# EAGLE design MIDI-Patchbay-Display (EAGLE 8.4.2)
RGB Rotary Encoder Breakout Board
CNAME: RGB Encoder Breakout; CREVISION: 1.0; DESIGNER: Andy Wardley
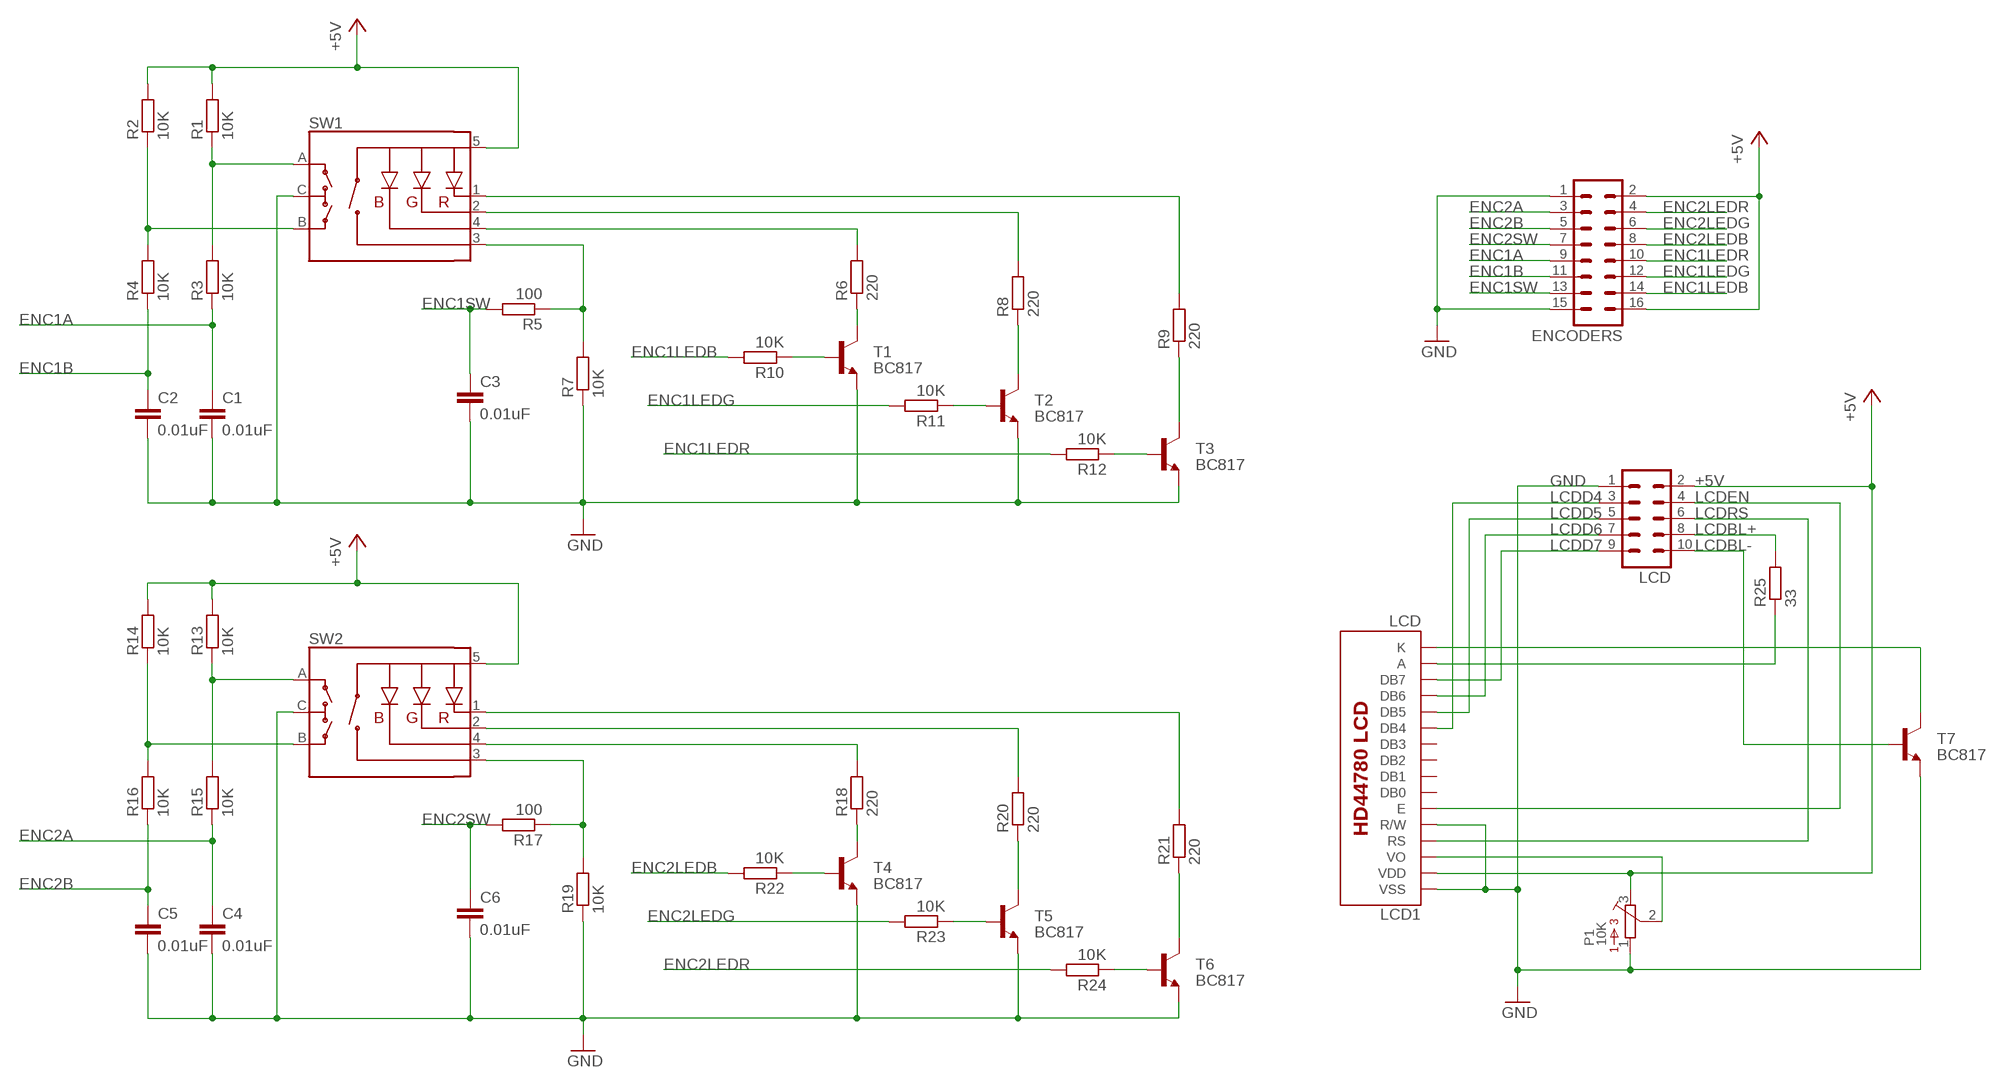
[diagram p0: schematic, sheet 1]

## Parts
C1  0.01uF  CAPACITOR  [0805]
C2  0.01uF  CAPACITOR  [0805]
C3  0.01uF  CAPACITOR  [0805]
C4  0.01uF  CAPACITOR  [0805]
C5  0.01uF  CAPACITOR  [0805]
C6  0.01uF  CAPACITOR  [0805]
ENCODERS  ML16  [ML16]
LCD  ML10  [ML10]
LCD1  LCD  LCD-HD447804-HOLES16X2-4-HOLES  [LCD-16X2-4HOLES]
P1  10K  3296W_TRIM_POT  [3386W]
R1  10K  RESISTORR0805  [R0805]
R2  10K  RESISTORR0805  [R0805]
R3  10K  RESISTORR0805  [R0805]
R4  10K  RESISTORR0805  [R0805]
R5  100  RESISTORR0805  [R0805]
R6  220  RESISTORR0805  [R0805]
R7  10K  RESISTORR0805  [R0805]
R8  220  RESISTORR0805  [R0805]
R9  220  RESISTORR0805  [R0805]
R10  10K  RESISTORR0805  [R0805]
R11  10K  RESISTORR0805  [R0805]
R12  10K  RESISTORR0805  [R0805]
R13  10K  RESISTORR0805  [R0805]
R14  10K  RESISTORR0805  [R0805]
R15  10K  RESISTORR0805  [R0805]
R16  10K  RESISTORR0805  [R0805]
R17  100  RESISTORR0805  [R0805]
R18  220  RESISTORR0805  [R0805]
R19  10K  RESISTORR0805  [R0805]
R20  220  RESISTORR0805  [R0805]
R21  220  RESISTORR0805  [R0805]
R22  10K  RESISTORR0805  [R0805]
R23  10K  RESISTORR0805  [R0805]
R24  10K  RESISTORR0805  [R0805]
R25  33  RESISTORR0805  [R0805]
SW1  ENCODER_RGB_CA  [ENCODER_LED_3]
SW2  ENCODER_RGB_CA  [ENCODER_LED_3]
T1  BC817  [SOT23]
T2  BC817  [SOT23]
T3  BC817  [SOT23]
T4  BC817  [SOT23]
T5  BC817  [SOT23]
T6  BC817  [SOT23]
T7  BC817  [SOT23]

## Nets
+5V: ENCODERS.2 ENCODERS.16 LCD1.2(VDD) LCD.2 P1.3 R1.2 R2.2 R13.2 R14.2 SW1.5(+) SW2.5(+)
ENC1A: C1.1 ENCODERS.9 R3.1
ENC1APIN: R1.1 R3.2 SW1.A
ENC1B: C2.1 ENCODERS.11 R4.1
ENC1BPIN: R2.1 R4.2 SW1.B
ENC1LEDB: ENCODERS.14 R10.2
ENC1LEDG: ENCODERS.12 R11.2
ENC1LEDR: ENCODERS.10 R12.2
ENC1SW: C3.1 ENCODERS.13 R5.2
ENC2A: C4.1 ENCODERS.3 R15.1
ENC2APIN: R13.1 R15.2 SW2.A
ENC2B: C5.1 ENCODERS.5 R16.1
ENC2BPIN: R14.1 R16.2 SW2.B
ENC2LEDB: ENCODERS.8 R22.2
ENC2LEDG: ENCODERS.6 R23.2
ENC2LEDR: ENCODERS.4 R24.2
ENC2SW: C6.1 ENCODERS.7 R17.2
GND: C1.2 C2.2 C3.2 C4.2 C5.2 C6.2 ENCODERS.1 ENCODERS.15 LCD1.1(VSS) LCD1.5(R/W) LCD.1 P1.1 R7.1 R19.1 SW1.C SW2.C T1.2(E) T2.2(E) T3.2(E) T4.2(E) T5.2(E) T6.2(E) T7.2(E)
LCDA: LCD1.15(A) R25.1
LCDBL+: LCD.8 R25.2
LCDBL-: LCD.10 T7.1(B)
LCDD4: LCD1.11(DB4) LCD.3
LCDD5: LCD1.12(DB5) LCD.5
LCDD6: LCD1.13(DB6) LCD.7
LCDD7: LCD1.14(DB7) LCD.9
LCDEN: LCD1.6(E) LCD.4
LCDK: LCD1.16(K) T7.3(C)
LCDRS: LCD1.4(RS) LCD.6
N$1: R6.1 T1.3(C)
N$2: R6.2 SW1.4(-B)
N$3: LCD1.3(VO) P1.2
N$4: R8.1 T2.3(C)
N$6: R10.1 T1.1(B)
N$7: R11.1 T2.1(B)
N$8: R8.2 SW1.2(-G)
N$9: R9.1 T3.3(C)
N$10: R12.1 T3.1(B)
N$11: R9.2 SW1.1(-R)
N$12: R5.1 R7.2 SW1.3(SW)
N$15: R18.2 SW2.4(-B)
N$16: R18.1 T4.3(C)
N$17: R22.1 T4.1(B)
N$18: R20.1 T5.3(C)
N$19: R23.1 T5.1(B)
N$20: R20.2 SW2.2(-G)
N$21: R21.1 T6.3(C)
N$22: R24.1 T6.1(B)
N$23: R21.2 SW2.1(-R)
N$24: R17.1 R19.2 SW2.3(SW)
Unconnected: LCD1.7(DB0) LCD1.8(DB1) LCD1.9(DB2) LCD1.10(DB3)

## Library data of the parts
C1-C6 = abw:CAPACITOR: Capacitor
ENCODERS = con-harting-ml:ML16: HARTING; OC_FARNELL: unknown; OC_NEWARK: unknown
LCD = con-ml:ML10: HARTING; OC_FARNELL: unknown; OC_NEWARK: unknown
LCD1 = abw:LCD-HD44780
P1 = abw:3296W_TRIM_POT: Bourns 3296W Trim Pot
R1-R25 = abw:RESISTOR: RESISTOR, European symbol
SW1 SW2 = abw:ENCODER_RGB_CA: Illuminated Rotary Encoder w/ RGB LED and select switch EC12PLRGBSDVBF-D: http://top-up.so-buy.com/front/bin/ptdetail.phtml?Part=EC12PLRGBSDVBF-D
T1-T7 = abw:BC817: General purpose NPN transistor SMD

## Net classes
2 gnd: width 0.305 mm, drill 0.711 mm, clearance 0.203 mm
3 usbvcc: width 0.508 mm, drill 0.711 mm, clearance 0.203 mm

## Board
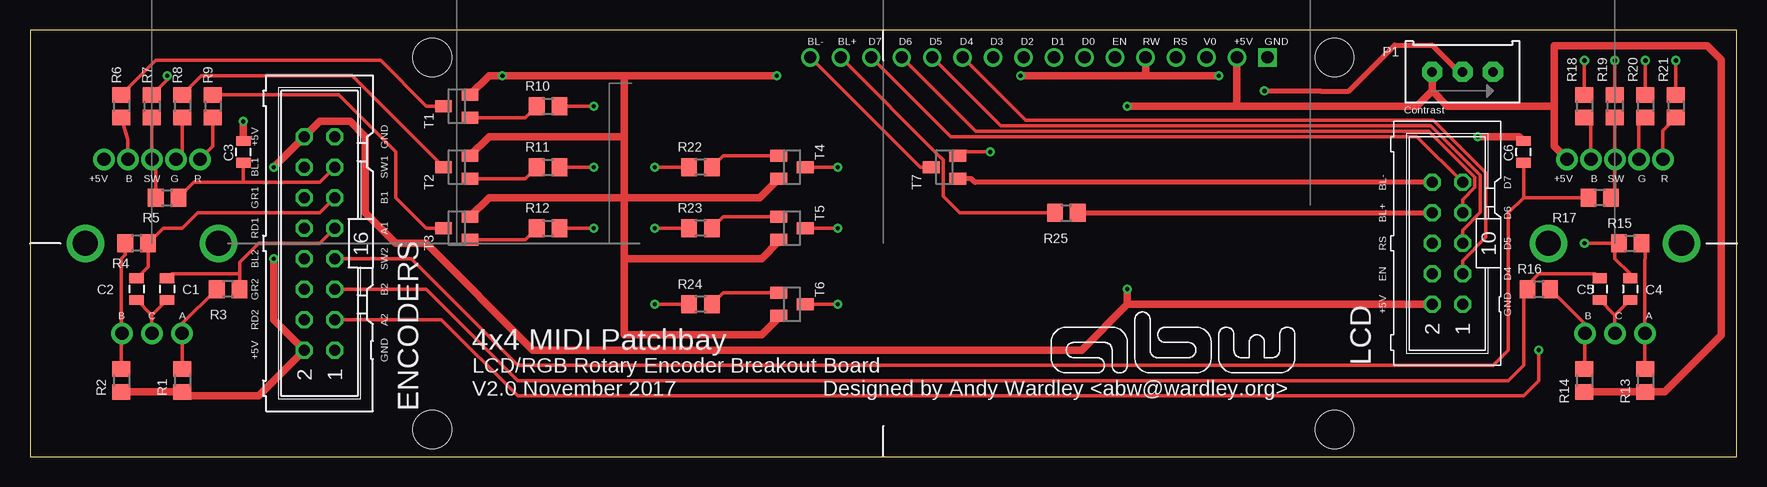
[diagram p1: board, top side]
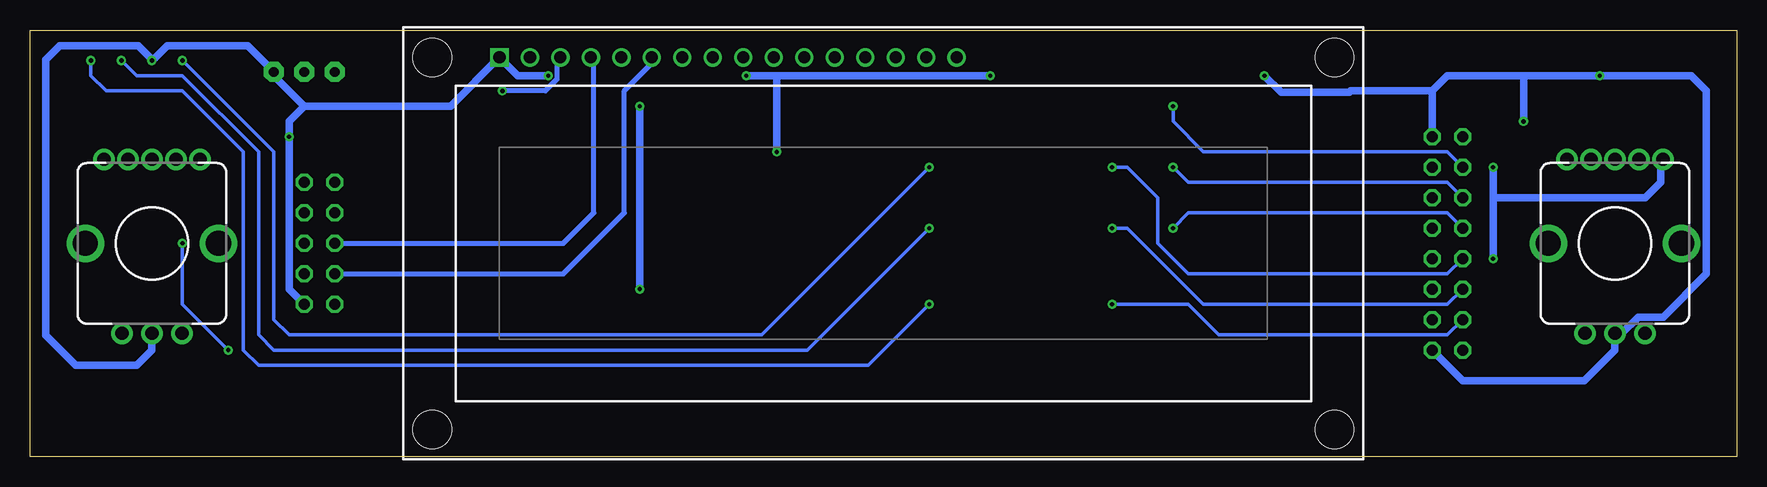
[diagram p2: board, bottom side, seen from below]

Size 142.24 x 35.56 mm. Coordinates in mm from the lower left corner, seen from the top.
Outline: 0,0 142.24,0 142.24,35.56 0,35.56 0,0
Copper layers (1*16): Top 0.035mm / dielectric 1.5mm / Bottom 0.035mm
Design rules "default": minimum track width 6mil, minimum drill 0.35mm, track to track 6mil, track to pad 6mil, pad to pad 6mil, via to via 6mil, smd to smd 6mil, copper to edge 40mil, drill to drill 6mil, minimum pad ring 10mil, minimum via ring 8mil, stop-mask expansion 4mil, vias tented up to drill 0mil, thermal gap 10mil

### Footprints (pad centres in the part's own frame; a part is rotated, then mirrored left to right if it is on the bottom)
0805 = smd 0.8 x 1.2: 1 -0.9,0; 2 0.9,0
ML16 = drill 0.914 octagon: 1 -8.89,-1.27; 2 -8.89,1.27; 3 -6.35,-1.27; 4 -6.35,1.27; 5 -3.81,-1.27; 6 -3.81,1.27; 7 -1.27,-1.27; 8 -1.27,1.27; 9 1.27,-1.27; 10 1.27,1.27; 11 3.81,-1.27; 12 3.81,1.27; 13 6.35,-1.27; 14 6.35,1.27; 15 8.89,-1.27; 16 8.89,1.27
ML10 = drill 0.914 octagon: 1 -5.08,-1.27; 2 -5.08,1.27; 3 -2.54,-1.27; 4 -2.54,1.27; 5 0,-1.27; 6 0,1.27; 7 2.54,-1.27; 8 2.54,1.27; 9 5.08,-1.27; 10 5.08,1.27
LCD-16X2-4HOLES = drill 1.016 square: 1 -32,15.5 | drill 1.016: 2 -29.46,15.5; 3 -26.92,15.5; 4 -24.38,15.5; 5 -21.84,15.5; 6 -19.3,15.5; 7 -16.76,15.5; 8 -14.22,15.5; 9 -11.68,15.5; 10 -9.14,15.5; 11 -6.6,15.5; 12 -4.06,15.5; 13 -1.52,15.5; 14 1.02,15.5; 15 3.56,15.5; 16 6.1,15.5 | hole 3.2: -37.6,15.5; -37.6,-15.5; 37.6,-15.5; 37.6,15.5
3386W = drill 0.813 pad 1.676 octagon: 1 2.54,0.318; 2 0,0.318; 3 -2.54,0.318
R0805 = smd 1.3 x 1.5: 1 -0.95,0; 2 0.95,0
ENCODER_LED_3 = drill 1.1 pad 1.778: 1 -4,7; 2 -2,7; 3 0,7; 4 2,7; 5 4,7 | drill 1.1 pad 1.8: A -2.5,-7.5; B 2.5,-7.5; C 0,-7.5 | drill 2.1: M1 -5.55,0; M2 5.55,0
SOT23 = smd 1 x 1.4: 1 -0.95,-1.1; 2 0.95,-1.1; 3 0,1.1

### Placement (x,y rotation side)
C1  11.43,13.97 270 top
C2  8.89,13.97 270 top
C3  17.78,25.4 90 top
C4  133.35,13.97 270 top
C5  130.81,13.97 270 top
C6  124.46,25.4 90 top
ENCODERS  24.13,17.78 90 top
LCD  118.11,17.78 90 top
LCD1  71.12,17.78 0 bottom
P1  119.38,31.75 0 top
R1  12.7,6.35 270 top
R2  7.62,6.35 270 top
R3  16.51,13.97 180 top
R4  8.89,17.78 180 top
R5  11.43,21.59 0 top
R6  7.62,29.21 270 top
R7  10.16,29.21 270 top
R8  12.7,29.21 270 top
R9  15.24,29.21 270 top
R10  43.18,29.21 0 top
R11  43.18,24.13 0 top
R12  43.18,19.05 0 top
R13  134.62,6.35 270 top
R14  129.54,6.35 270 top
R15  133.35,17.78 0 top
R16  125.73,13.97 0 top
R17  130.81,21.59 180 top
R18  129.54,29.21 270 top
R19  132.08,29.21 270 top
R20  134.62,29.21 270 top
R21  137.16,29.21 270 top
R22  55.88,24.13 180 top
R23  55.88,19.05 180 top
R24  55.88,12.7 180 top
R25  86.36,20.32 0 top
SW1  10.16,17.78 0 bottom
SW2  132.08,17.78 0 bottom
T1  35.56,29.21 90 top
T2  35.56,24.13 90 top
T3  35.56,19.05 90 top
T4  63.5,24.13 270 top
T5  63.5,19.05 270 top
T6  63.5,12.7 270 top
T7  76.2,24.13 90 top
U$1  [ABWLOGO-MICRO]  95.25,8.89 0 top

### Tracks (layer width: path | path; a pad name or v marks a point on that pad's centre or on a via)
+5V  (via drill 0.35)
  Top 0.61: R14.2 R13.2 136.21,5.4 140.92,10.11 140.92,33.07 139.76,34.23 127,34.23 127,29.21 | SW2.5 127,25.86 127,29.21 | R2.2 R1.2 13.02,5.08 19.05,5.08 ENCODERS.2 20.32,11.43 v20.32,16.51 | v20.32,24.13 ENCODERS.16 24.13,27.94 26.67,27.94 27.94,26.67 27.94,20.32 30.48,17.78 33.02,17.78 41.91,8.89 87.63,8.89 91.44,12.7 | 116.84,30.48 P1.3 | 116.84,30.48 118.11,29.21 127,29.21 | 116.84,30.48 115.57,29.21 100.33,29.21 | 100.33,29.21 v91.44,29.21 | LCD1.2 100.58,29.46 100.33,29.21 | LCD.2 91.44,12.7 | 91.44,12.7 v91.44,13.97
  Bottom 0.61: v20.32,24.13 20.32,21.59 | 20.32,21.59 v20.32,16.51 | 20.32,21.59 7.62,21.59 6.35,22.86 6.35,24.59 SW1.5 | v91.44,29.21 v91.44,13.97
ENC1A
  Top 0.305: 17.46,15.24 R3.1 | 17.46,15.24 17.46,16.19 19.05,17.78 24.13,17.78 ENCODERS.9 | C1.1 11.8,15.24 17.46,15.24
ENC1APIN
  Top 0.305: R1.1 12.7,10.24 SW1.A 12.66,11.07 R3.2
ENC1B
  Top 0.305: ENCODERS.11 24.13,20.32 13.97,20.32 12.7,19.05 11.11,19.05 R4.1 9.84,15.82 C2.1
ENC1BPIN
  Top 0.305: R2.1 7.62,10.24 SW1.B 7.62,10.32 7.62,16.51 7.94,16.83 R4.2
ENC1LEDB  (via drill 0.35)
  Top 0.305: R10.2 v46.99,29.21
  Bottom 0.305: v46.99,29.21 46.99,27.94 44.45,25.4 24.13,25.4 ENCODERS.14
ENC1LEDG  (via drill 0.35)
  Top 0.305: R11.2 v46.99,24.13
  Bottom 0.305: v46.99,24.13 45.72,22.86 24.13,22.86 ENCODERS.12
ENC1LEDR  (via drill 0.35)
  Top 0.305: R12.2 v46.99,19.05
  Bottom 0.305: v46.99,19.05 45.72,20.32 24.13,20.32 ENCODERS.10
ENC1SW
  Top 0.305: R5.2 13.65,22.86 17.78,22.86 | 17.78,22.86 24.13,22.86 ENCODERS.13 | C3.1 17.78,22.86
ENC2A  (via drill 0.35)
  Top 0.305: C4.1 133.35,15.24 132.08,16.51 132.08,17.46 R15.1 v129.54,17.78 | ENCODERS.3 34.29,11.43 40.64,5.08 124.46,5.08 125.73,6.35 v125.73,8.89
  Bottom 0.305: v129.54,17.78 129.54,12.7 v125.73,8.89
ENC2APIN
  Top 0.305: R15.2 134.62,17.46 134.62,16.51 134.58,16.47 SW2.A 134.58,7.34 R13.1
ENC2B
  Top 0.305: C5.1 130.44,15.24 125.73,15.24 124.78,14.29 R16.1 124.46,13.65 124.46,7.62 123.19,6.35 40.64,6.35 33.02,13.97 ENCODERS.5
ENC2BPIN
  Top 0.305: R16.2 129.58,11.07 SW2.B 129.58,7.34 R14.1
ENC2LEDB  (via drill 0.35)
  Top 0.305: R22.2 v52.07,24.13
  Bottom 0.305: v52.07,24.13 50.8,24.13 48.26,21.59 48.26,17.78 45.72,15.24 24.13,15.24 ENCODERS.8
ENC2LEDG  (via drill 0.35)
  Top 0.305: R23.2 v52.07,19.05
  Bottom 0.305: v52.07,19.05 50.8,19.05 44.45,12.7 24.13,12.7 ENCODERS.6
ENC2LEDR  (via drill 0.35)
  Top 0.305: R24.2 v52.07,12.7
  Bottom 0.305: ENCODERS.4 24.13,10.16 43.18,10.16 45.72,12.7 v52.07,12.7
ENC2SW
  Top 0.305: 124.46,21.59 R17.2 | 124.46,21.59 123.19,20.32 123.19,8.89 121.92,7.62 40.64,7.62 31.75,16.51 ENCODERS.7 | C6.1 124.46,21.59
GND  (via drill 0.35)
  Top 0.305: SW2.C 132.08,11.8 | 132.08,11.8 C5.2 | 132.08,11.8 C4.2 | SW1.C 10.16,11.8 | 10.16,11.8 C1.2 | 10.16,11.8 C2.2 | R19.1 v132.08,33.02 | T7.2 77.62,25.4 v80.01,25.4 | R7.1 11.43,31.43 v11.43,31.75
  Top 0.61: T4.2 60.81,21.59 49.53,21.59 | 49.53,21.59 49.53,16.51 | 49.53,16.51 49.53,10.16 60.96,10.16 62.4,11.6 T6.2 | 49.53,26.67 49.53,21.59 | 49.53,26.67 49.53,31.75 | 49.53,16.51 60.96,16.51 62.4,17.95 T5.2 | T3.2 38.25,21.59 49.53,21.59 | T2.2 38.25,26.67 49.53,26.67 | T1.2 38.25,31.75 v39.37,31.75 49.53,31.75 | 49.53,31.75 v62.23,31.75 | v82.55,31.75 92.71,31.75 | 92.71,31.75 v99.06,31.75 | 92.71,31.75 92.96,32 LCD1.5 | C3.2 v17.78,27.94 | v120.65,26.67 124.09,26.67 C6.2
  Bottom 0.61: ENCODERS.1 22.86,6.35 12.7,6.35 10.16,8.89 SW1.C 9.58,10.28 8.22,11.64 6.14,11.64 2.54,15.24 2.54,30.48 3.81,31.75 v11.43,31.75 17.78,31.75 | LCD1.1 107.19,29.21 119.38,29.21 | LCD1.1 | 119.38,29.21 121.92,31.75 P1.1 124.08,34.23 130.81,34.23 132.02,33.02 | 132.02,33.02 v132.08,33.02 | LCD.1 120.65,13.97 v120.65,26.67 120.65,27.94 119.38,29.21 | SW2.C 132.08,8.89 133.35,7.62 138.43,7.62 140.92,10.11 140.92,33.07 139.76,34.23 133.23,34.23 132.02,33.02 | v62.23,31.75 80.01,31.75 | 80.01,31.75 v82.55,31.75 | v80.01,25.4 80.01,31.75 | 17.78,31.75 24.13,31.75 25.4,30.48 | 25.4,30.48 ENCODERS.15 | 25.4,30.48 32.19,30.48 32.31,30.36 37.98,30.36 v39.37,31.75 | v99.06,31.75 101.6,31.75 LCD1.1 | v17.78,27.94 17.78,31.75
LCDA
  Top 0.305: LCD1.15 75.91,24.93 75.93,24.93 76.11,24.76 76.11,21.68 77.47,20.32 R25.1
LCDBL+
  Top 0.406: R25.2 LCD.8
LCDBL-
  Top 0.406: LCD.10 78.74,22.86 78.42,23.18 T7.1
LCDD4
  Top 0.305: LCD1.11 82.96,28.04 116.93,28.04 121.31,23.66 121.31,18.27 119.38,16.34 LCD.3
LCDD5
  Top 0.305: LCD1.12 80.88,27.58 116.74,27.58 120.85,23.47 120.85,20.36 119.38,18.88 LCD.5
LCDD6
  Top 0.305: LCD1.13 78.79,27.13 116.55,27.13 120.4,23.28 120.4,22.44 119.38,21.42 LCD.7
LCDD7
  Top 0.305: LCD1.14 76.71,26.67 115.57,26.67 LCD.9
LCDEN
  Bottom 0.406: LCD.4 108.46,15.24 97.79,15.24 92.71,20.32 92.71,30.48 90.42,32.77 LCD1.6
LCDK
  Top 0.305: LCD1.16 74.17,24.13 T7.3
LCDRS
  Bottom 0.406: LCD.6 111,17.78 97.79,17.78 95.25,20.32 95.25,33.03 LCD1.4
N$1
  Top 0.305: R6.1 10.48,33.02 29.21,33.02 33.02,29.21 T1.3
N$2
  Top 0.305: SW1.4 8.16,26.45 R6.2
N$3  (via drill 0.35)
  Top 0.406: v102.87,30.48 107.53,30.48 107.55,30.46 109.89,30.46 113.72,34.29 116.84,34.29 119.06,32.07 P1.2
  Bottom 0.406: LCD1.3 98.33,32.99 98.33,31.45 99.29,30.48 v102.87,30.48
N$4
  Top 0.305: R8.1 14.29,31.75 26.84,31.75 T2.3
N$6
  Top 0.305: 36.98,27.94 T1.1 41.28,28.26 R10.1
N$7
  Top 0.305: T2.1 41.28,23.18 R11.1
N$8
  Top 0.305: SW1.2 12.7,25.32 R8.2
N$9
  Top 0.305: R9.1 25.72,30.16 30.48,25.4 30.48,21.59 33.02,19.05 T3.3
N$10
  Top 0.305: T3.1 41.28,18.1 R12.1
N$11
  Top 0.305: SW1.1 15.24,25.86 R9.2
N$12
  Top 0.305: R7.2 SW1.3 10.48,24.46 R5.1
N$15
  Top 0.305: SW2.4 130.08,27.72 R18.2
N$16  (via drill 0.35)
  Top 0.305: 129.22,30.48 R18.1 v129.54,33.02 | T4.3 v67.31,24.13
  Bottom 0.305: v67.31,24.13 81.28,10.16 120.65,10.16 121.92,11.43 121.92,25.4 v129.54,33.02
N$17
  Top 0.305: T4.1 57.78,25.08 R22.1
N$18  (via drill 0.35)
  Top 0.305: R20.1 v134.62,33.02 | T5.3 v67.31,19.05
  Bottom 0.305: v67.31,19.05 77.47,8.89 121.92,8.89 123.19,10.16 123.19,25.4 129.54,31.75 133.35,31.75 v134.62,33.02
N$19
  Top 0.305: T5.1 57.78,20 R23.1
N$20
  Top 0.305: SW2.2 134.08,27.72 R20.2
N$21  (via drill 0.35)
  Top 0.305: R21.1 v137.16,33.02 | T6.3 v67.31,12.7
  Bottom 0.305: v67.31,12.7 72.39,7.62 123.19,7.62 124.46,8.89 124.46,25.4 129.54,30.48 135.89,30.48 137.16,31.75 v137.16,33.02
N$22
  Top 0.305: T6.1 57.78,13.65 R24.1
N$23
  Top 0.305: SW2.1 136.08,27.18 R21.2
N$24
  Top 0.305: R19.2 SW2.3 132.08,21.91 R17.1

### Text on the board
tPlace: BL- | BL+ | D7 | D6 | D5 | D4 | D3 | D2 | D1 | D0 | EN | RW | RS | V0 | +5V | GND | Contrast | +5V | GND | BL1 | SW1 | +5V | B | SW | G | R | BL- | D7 | +5V | B | SW | G | R | GR1 | B1 | BL+ | D6 | RD1 | A1 | RS | D5 | BL2 | SW2 | EN | D4 | GR2 | B2 | +5V | GND | B | C | A | RD2 | A2 | B | C | A | +5V | GND | 4x4 MIDI Patchbay | LCD/RGB Rotary Encoder Breakout Board / V2.0 November 2017 | Designed by Andy Wardley <abw@wardley.org>